# Altium project WB-AV-4503-Switching-Circuit.PrjPcb
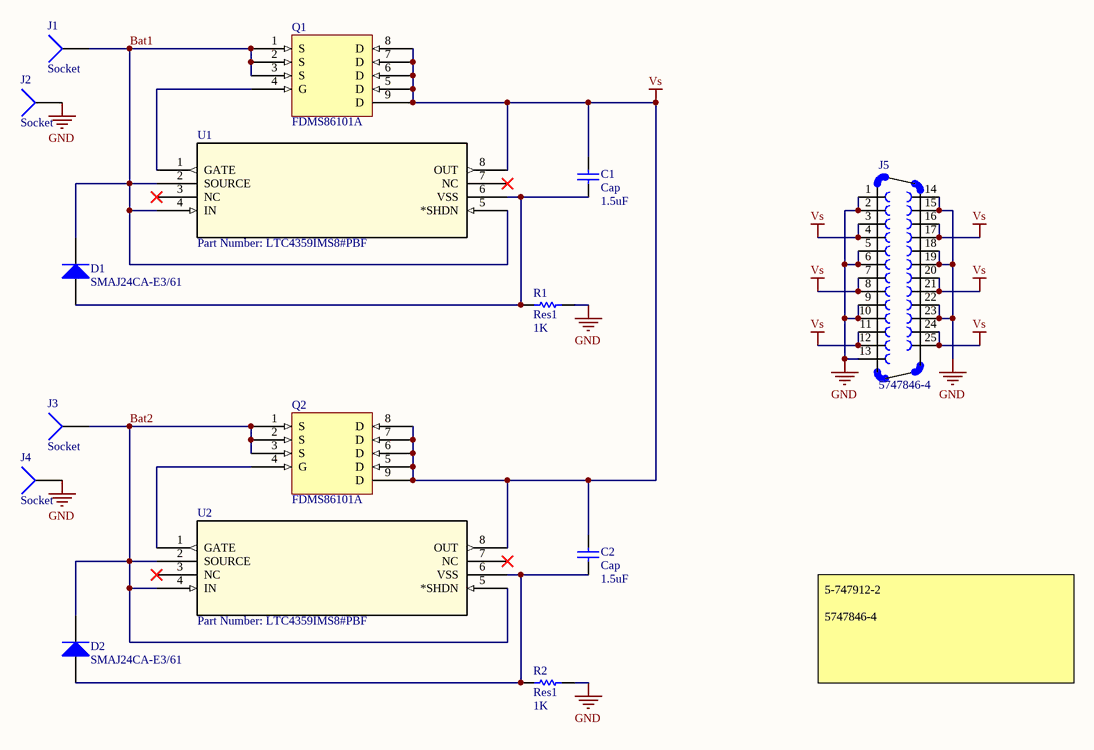
[diagram p0: Redundant Batteries.SchDoc]
1 sheet, 15 parts. Net scope: global (net labels, ports and power ports of the same name join across sheets).
Board file: WB-AV-4503-Switching-Circuit-REV-0.pcbdoc

## Sheet Redundant Batteries.SchDoc
size A4

### Parts
C1  Cap  value 1.5uF  [C1210_M]
C2  Cap  value 1.5uF  [C1210_M]
D1  SMAJ24CA-E3/61  [DIODE_DO-214AC]
D2  SMAJ24CA-E3/61  [DIODE_DO-214AC]
J1  Socket  [PCBComponent_1]
J2  Socket  [PCBComponent_1]
J3  Socket  [PCBComponent_1]
J4  Socket  [PCBComponent_1]
J5  5747846-4  [*TE_5747846-4]
Q1  FDMS86101A  [FDMS86101A]
Q2  FDMS86101A  [FDMS86101A]
R1  Res1  value 1K  [STA_RMCF2512]
R2  Res1  value 1K  [STA_RMCF2512]
U1  Part Number: LTC4359IMS8#PBF  [MSOP-8_MS]
U2  Part Number: LTC4359IMS8#PBF  [MSOP-8_MS]

### Nets
GND: J2.1 J4.1 J5.1 J5.2 J5.5 J5.6 J5.9 J5.10 J5.13 J5.14 J5.15 J5.18 J5.19 J5.22 J5.23 R1.2 R2.2
Vs: C1.2 C2.2 J5.3 J5.4 J5.7 J5.8 J5.11 J5.12 J5.16 J5.17 J5.20 J5.21 J5.24 J5.25 Q1.5(D) Q1.6(D) Q1.7(D) Q1.8(D) Q1.9(D) Q2.5(D) Q2.6(D) Q2.7(D) Q2.8(D) Q2.9(D) U1.8(OUT) U2.8(OUT)
Bat1: D1.2(K) J1.1 Q1.1(S) Q1.2(S) Q1.3(S) U1.2(SOURCE) U1.4(IN) U1.5(*SHDN)
Bat2: D2.2(K) J3.1 Q2.1(S) Q2.2(S) Q2.3(S) U2.2(SOURCE) U2.4(IN) U2.5(*SHDN)
NetC1_1: C1.1 D1.1(A) R1.1 U1.6(VSS)
NetC2_1: C2.1 D2.1(A) R2.1 U2.6(VSS)
NetQ1_4: Q1.4(G) U1.1(GATE)
NetQ2_4: Q2.4(G) U2.1(GATE)

Not connected (* = marked no-connect by the designer): U1 3(NC)* 7(NC)*; U2 3(NC)* 7(NC)*

### Notes on the sheet
- 5-747912-2
  5747846-4

### Library data of the parts
C1 C2 = Cap: Capacitor; SPN: 445-7586-1-ND; Published: 8-Jun-2000; LatestRevisionDate: 17-Jul-2002; LatestRevisionNote: Re-released for DXP Platform.; PackageReference: RAD-0.3; Publisher: Altium Limited; PackageDescription: Radial Cap, Thru-Hole; 2 Leads; 0.3 in Pin Spacing
D1 D2 = Diode: Default Diode; SPN: SMAJ24CA-E3/61GICT-ND; Published: 8-Jun-2000; LatestRevisionDate: 17-Jul-2002; LatestRevisionNote: Re-released for DXP Platform.; PackageVersion: Sep-1996; PackageReference: SMC; Publisher: Altium Limited; PackageDescription: DO-214-AB/SMC; 2 C-Bend Leads; Body 7.9 x 5.9 mm, inc. leads (LxW); Code_JEDEC: DO-214-AB
Q1 Q2 = FDMS86101A: MOSFET N-CH 100V 13A POWER56; SPN: FDMS86101ACT-ND
R1 R2 = Res1: Resistor; SPN: RMCF2512JT1K00CT-ND; Published: 8-Jun-2000; LatestRevisionDate: 17-Jul-2002; LatestRevisionNote: Re-released for DXP Platform.; PackageReference: AXIAL-0.3; Publisher: Altium Limited; PackageDescription: Axial Device, Thru-Hole; 2 Leads; 0.3 in Pin Spacing
U1 U2 = LTC4359IMS8#PBF: No Description Available; Vendor: Linear Technology; Built_By: EMA_UL_Team; Manufacturer_Part_Number: LTC4359IMS8#PBF; Copyright: Copyright (C) 2018 Accelerated Designs. All rights reserved; RefDes: RefDes; Type: DEV; Value: Value
J1-J4 = Socket: LatestRevisionDate: 17-Jul-2002; LatestRevisionNote: Re-released for DXP Platform.; Publisher: Altium Limited
J5 = 5747846-4: SnapEDA_Link: https://www.snapeda.com/parts/5747846-4/TE%20Connectivity%20AMP%20Connectors/view-part/2759124/?ref=snap; Value: *